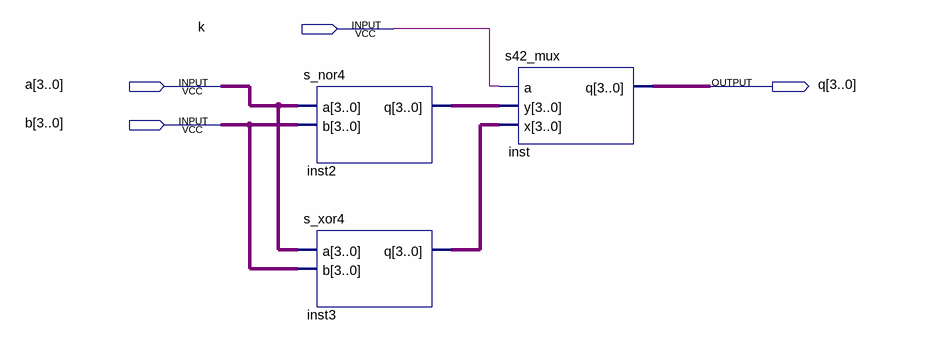
[diagram p0: schematic sheet]
// Quartus schematic s44_alu.bdf as structural Verilog: 3 symbols, 4 pins
module s44_alu (
  input  k,
  input  [3:0] a,
  input  [3:0] b,
  output [3:0] q
);

  wire [3:0] inst2_q, inst3_q;

  s_nor4 inst2 (.a(a), .b(b), .q(inst2_q));
  s_xor4 inst3 (.a(a), .b(b), .q(inst3_q));
  s42_mux inst (.a(k), .y(inst2_q), .x(inst3_q), .q(q));
endmodule
